# EAGLE design boosterpack (EAGLE 6.5.0)
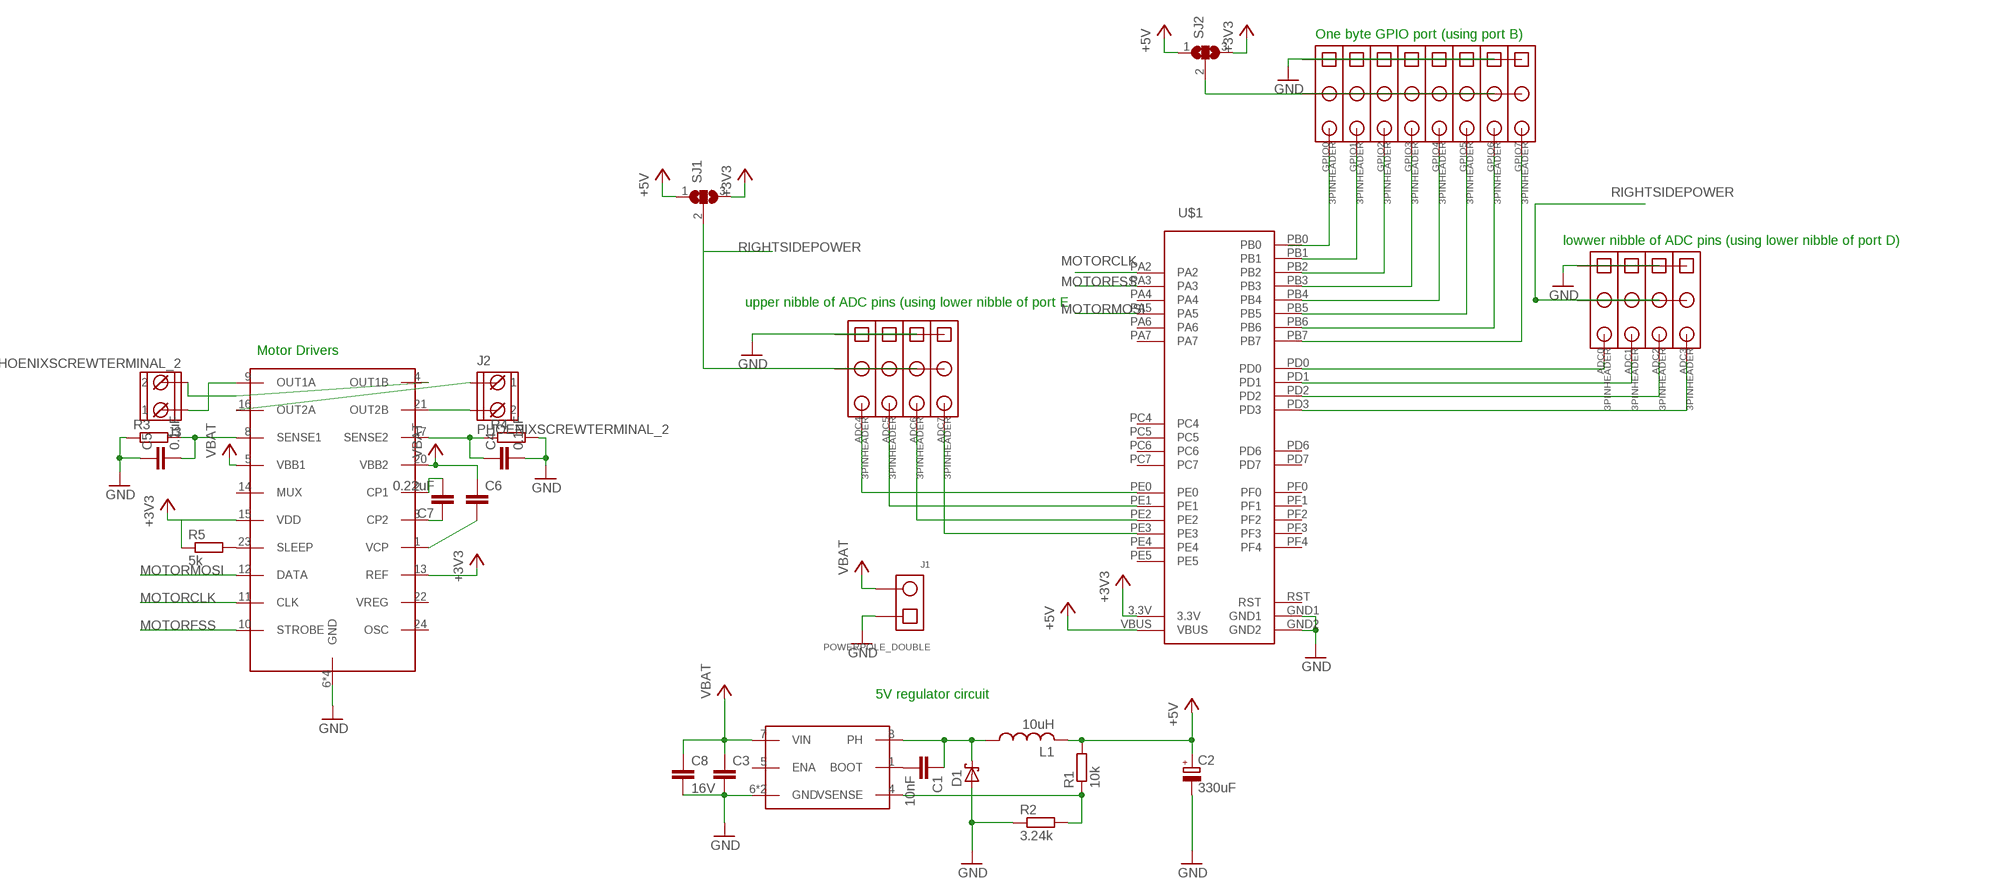
[diagram p0: schematic, sheet 1]

## Parts
ADC0  3PINHEADER  [3PINHEADER]
ADC1  3PINHEADER  [3PINHEADER]
ADC2  3PINHEADER  [3PINHEADER]
ADC3  3PINHEADER  [3PINHEADER]
ADC4  3PINHEADER  [3PINHEADER]
ADC5  3PINHEADER  [3PINHEADER]
ADC6  3PINHEADER  [3PINHEADER]
ADC7  3PINHEADER  [3PINHEADER]
C1  10nF  C-EU025-024X044  [C025-024X044]
C2  330uF  CPOL-EUB45181B  [B45181B]
C3  C-EU025-024X044  [C025-024X044]
C4  0.1uF  C-EU025-025X050  [C025-025X050]
C5  0.1uF  C-EU025-025X050  [C025-025X050]
C6  C-EU025-025X050  [C025-025X050]
C7  0.22uF  C-EU025-024X044  [C025-024X044]
C8  16V  C-EU050-075X075  [C050-075X075]
D1  SCHOTTKY-DIODEDO201T15  [DO201T15]
GPIO0  3PINHEADER  [3PINHEADER]
GPIO1  3PINHEADER  [3PINHEADER]
GPIO2  3PINHEADER  [3PINHEADER]
GPIO3  3PINHEADER  [3PINHEADER]
GPIO4  3PINHEADER  [3PINHEADER]
GPIO5  3PINHEADER  [3PINHEADER]
GPIO6  3PINHEADER  [3PINHEADER]
GPIO7  3PINHEADER  [3PINHEADER]
J1  POWERPOLE_DOUBLE  [POWERPOLE_DOUBLE]
J2  PHOENIXSCREWTERMINAL_2  [PHOENIXSCREWTERMINAL_2]
J3  PHOENIXSCREWTERMINAL_2  [PHOENIXSCREWTERMINAL_2]
L1  10uH  SDR1006  [SDR1006]
R1  10k  R-EU_0204/7  [0204/7]
R2  3.24k  R-EU_0204/7  [0204/7]
R3  R-EU_0204/7  [0204/7]
R4  R-EU_0204/7  [0204/7]
R5  5k  R-EU_0204/7  [0204/7]
SJ1  SJ2W  [SJ_2]
SJ2  SJ2W  [SJ_2]
U$1  STELLARIS-LAUNCHPADSTELLARIS-LAUNCHPAD-XL  [LAUNCHPAD-XL]
U$2  TPS5450  [DDS]
U$3  A3992A  [DIP24]

## Nets
+3V3: R5.1 SJ1.3 SJ2.3 U$1.3.3V U$3.13(REF) U$3.15(VDD)
+5V: C2.+ L1.P$2 R1.2 SJ1.1 SJ2.1 U$1.VBUS
ADC1: ADC1.3 U$1.PD1
ADC2: ADC2.3 U$1.PD2
ADC3: ADC3.3 U$1.PD3
ADC5: ADC5.3 U$1.PE1
GND: ADC0.1 ADC1.1 ADC2.1 ADC3.1 ADC4.1 ADC5.1 ADC6.1 ADC7.1 C2.- C3.2 C4.2 C5.1 C8.2 D1.A GPIO0.1 GPIO1.1 GPIO2.1 GPIO3.1 GPIO4.1 GPIO5.1 GPIO6.1 GPIO7.1 J1.1 R2.1 R3.1 R4.2 U$1.GND1 U$1.GND2 U$2.6(GND) U$2.GROUNDPAD(GND) U$3.6(GND) U$3.7(GND) U$3.18(GND) U$3.19(GND)
GPIO0: GPIO0.3 U$1.PB0
GPIO1: GPIO1.3 U$1.PB1
GPIO2: GPIO2.3 U$1.PB2
GPIO3: GPIO3.3 U$1.PB3
MOTORCLK: U$1.PA2 U$3.11(CLK)
MOTORFSS: U$1.PA3 U$3.10(STROBE)
MOTORMOSI: U$1.PA5 U$3.12(DATA)
N$1: ADC0.3 U$1.PD0
N$2: GPIO4.3 U$1.PB4
N$3: GPIO5.3 U$1.PB5
N$4: ADC6.3 U$1.PE2
N$5: ADC7.3 U$1.PE3
N$6: GPIO6.3 U$1.PB6
N$7: GPIO0.2 GPIO1.2 GPIO2.2 GPIO3.2 GPIO4.2 GPIO5.2 GPIO6.2 GPIO7.2 SJ2.2
N$8: GPIO7.3 U$1.PB7
N$9: C1.2 U$2.1(BOOT)
N$10: R1.1 R2.2 U$2.4(VSENSE)
N$11: C1.1 D1.C L1.P$1 U$2.8(PH)
N$13: ADC4.3 U$1.PE0
N$14: J3.2 U$3.4(OUT1B)
N$15: J3.1 U$3.9(OUT1A)
N$17: J2.1 U$3.16(OUT2A)
N$18: J2.2 U$3.21(OUT2B)
N$19: C5.2 R3.2 U$3.8(SENSE1)
N$20: C4.1 R4.1 U$3.17(SENSE2)
N$21: C6.2 U$3.1(VCP)
N$22: R5.2 U$3.23(SLEEP)
N$23: C7.1 U$3.3(CP2)
N$28: C7.2 U$3.2(CP1)
RIGHTSIDEPOWER: ADC0.2 ADC1.2 ADC2.2 ADC3.2 ADC4.2 ADC5.2 ADC6.2 ADC7.2 SJ1.2
VCC: C3.1 C6.1 C8.1 J1.2 U$2.7(VIN) U$3.5(VBB1) U$3.20(VBB2) ; supply symbol labelled VBAT
Unconnected: U$1.PA4 U$1.PA6 U$1.PA7 U$1.PC4 U$1.PC5 U$1.PC6 U$1.PC7 U$1.PD6 U$1.PD7 U$1.PE4 U$1.PE5 U$1.PF0 U$1.PF1 U$1.PF2 U$1.PF3 U$1.PF4 U$2.5(ENA) U$3.14(MUX) U$3.22(VREG) U$3.24(OSC)

## Notes on the sheet
- One byte GPIO port (using port B)
- lowwer nibble of ADC pins (using lower nibble of port D)
- upper nibble of ADC pins (using lower nibble of port E
- Motor Drivers
- 5V regulator circuit

## Power pins joined to a net without a drawn wire
RST: U$1.RST

## Library data of the parts
ADC0 ADC1-ADC7 GPIO0 GPIO1-GPIO7 = RASEagleLib:3PINHEADER: 3 Pin Header 0.1" Headers
C1 C3-C8 = resistor:C-EU: CAPACITOR, European symbol
C2 = rcl:CPOL-EU: POLARIZED CAPACITOR, European symbol
D1 = diode:SCHOTTKY-DIODE: Schottky Diode
J1 = RASEagleLib:POWERPOLE_DOUBLE: Double PowerPole Connector Good for battery connections.
J2 J3 = RASEagleLib:PHOENIXSCREWTERMINAL_2: Phoenix Screw Terminal 2 contacts, 5 mm pitch Terminal: 1934861 Pins: 1933189
L1 = RASEagleLib:SDR1006
R1-R5 = rcl:R-EU_: RESISTOR, European symbol
SJ1 SJ2 = jumper:SJ2W: SMD solder JUMPER
U$1 = StellarisLaunchPad_Fred:STELLARIS-LAUNCHPAD
U$2 = packages(ti):TPS5450
U$3 = RASEagleLib:A3992

## Board
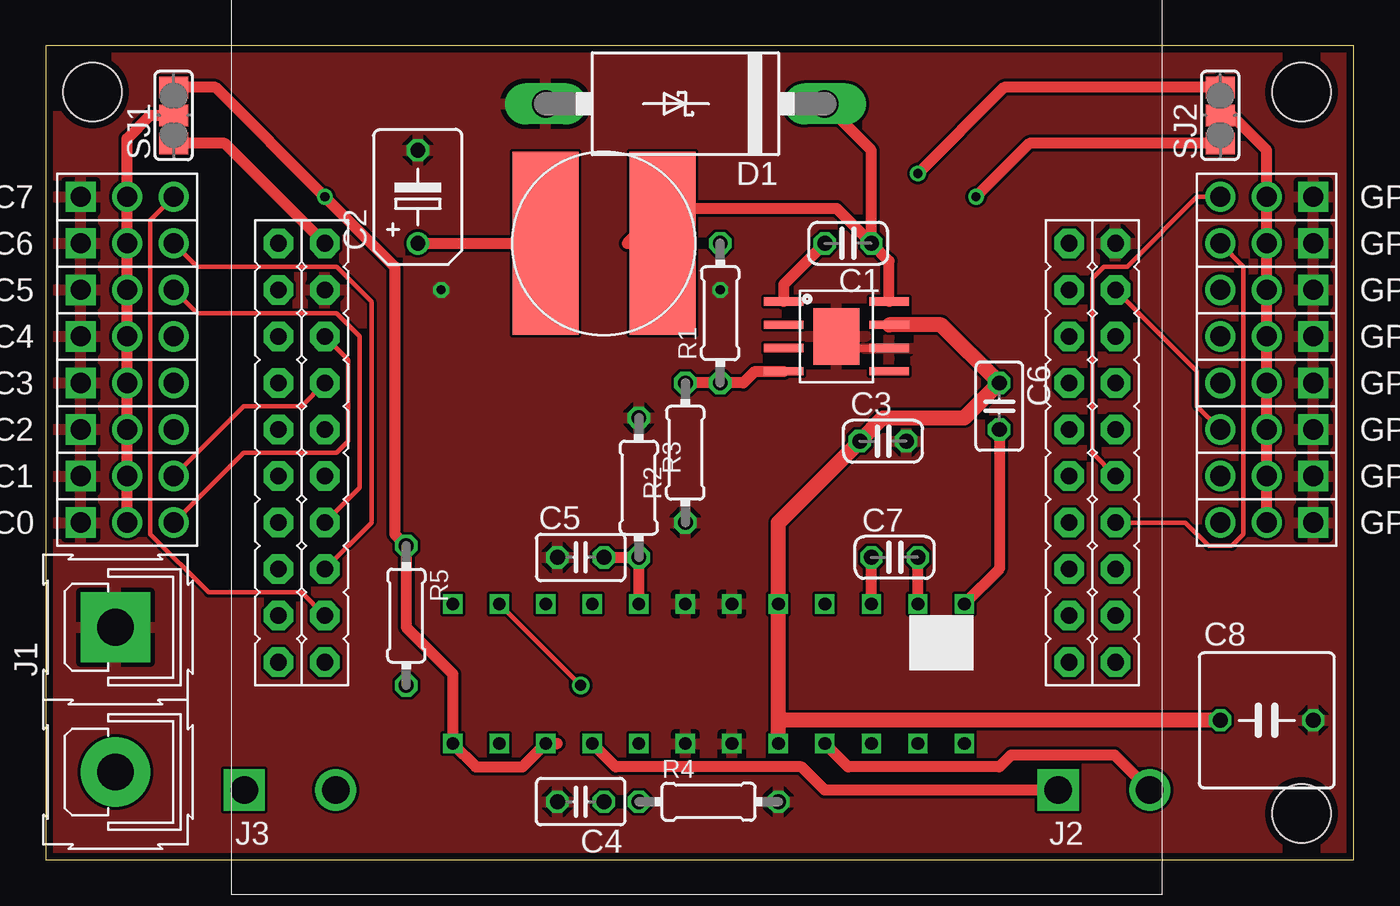
[diagram p1: board, top side]
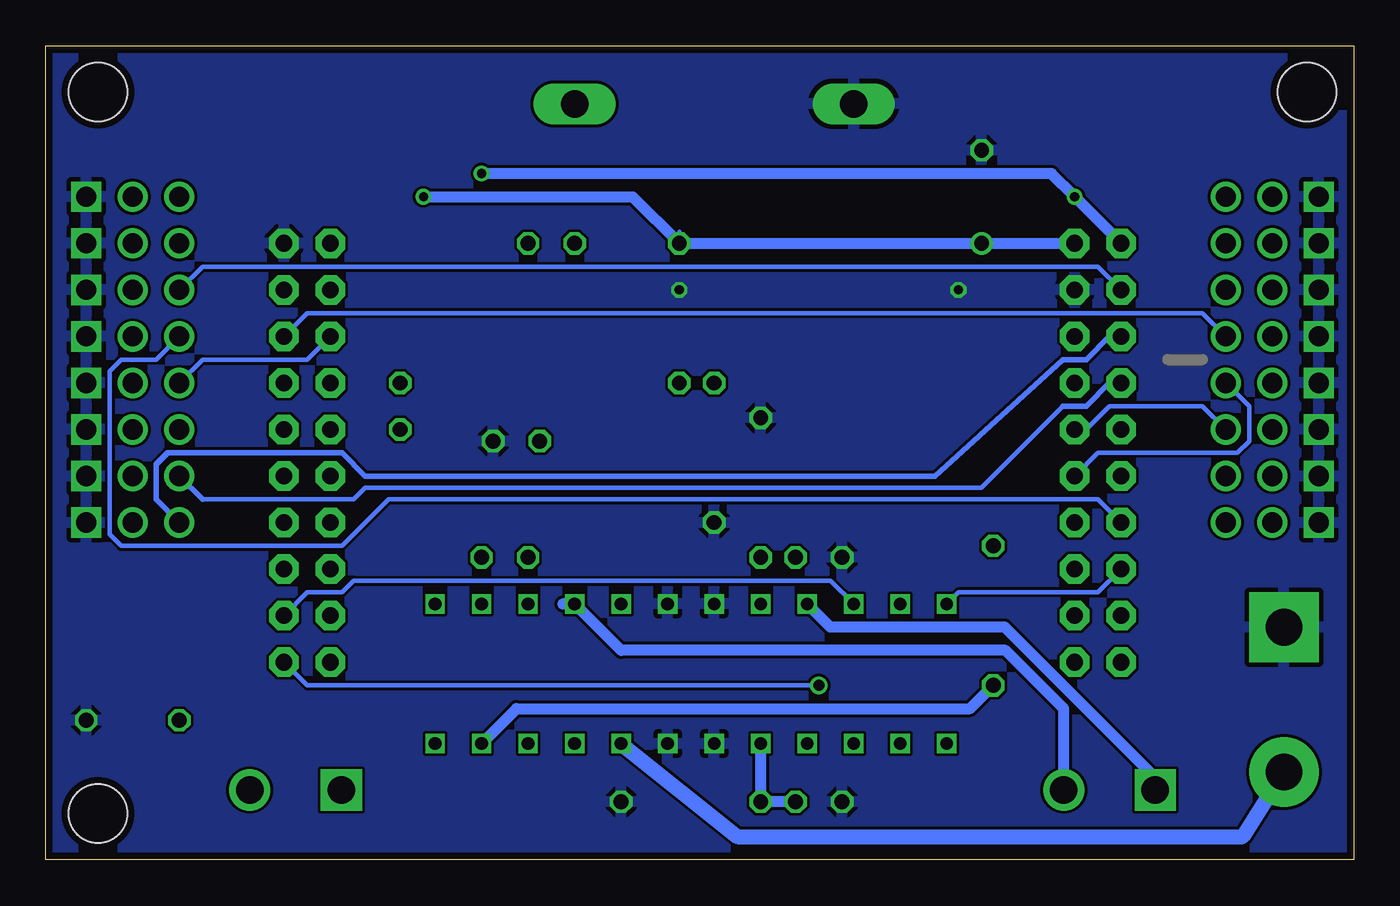
[diagram p2: board, bottom side, seen from below]

Size 71.42 x 44.44 mm. Coordinates in mm from the lower left corner, seen from the top.
Outline: 0,0 71.42,0 71.42,44.44 0,44.44 0,0
Copper layers (1*16): Top 0.0356mm / dielectric 1.5011mm / Bottom 0.0356mm
Design rules "LaenPCBOrder": minimum track width 6mil, minimum drill 13mil, track to track 6mil, track to pad 6mil, pad to pad 6mil, via to via 6mil, smd to smd 6mil, copper to edge 15mil, drill to drill 6mil, minimum pad ring 7mil, minimum via ring 7mil, stop-mask expansion 3mil, vias tented up to drill 0mil, thermal gap 10mil
Holes 3.2 mm at 2.54,41.91 68.58,41.91 68.58,2.54

### Footprints (pad centres in the part's own frame; a part is rotated, then mirrored left to right if it is on the bottom)
3PINHEADER = drill 1.1 square: 1 0,0 | drill 1.1: 2 2.54,0; 3 5.08,0
C025-024X044 = drill 0.813 octagon: 1 -1.27,0; 2 1.27,0
B45181B = drill 0.813: + -2.54,0 | drill 0.813 octagon: - 2.54,0
C025-025X050 = drill 0.813 octagon: 1 -1.27,0; 2 1.27,0
C050-075X075 = drill 0.813 octagon: 1 -2.54,0; 2 2.54,0
DO201T15 = drill 1.499 long: A 7.62,0; C -7.62,0
POWERPOLE_DOUBLE = drill 2 pad 3.81 square: 1 0,0 | drill 2 pad 3.81: 2 7.9,0
PHOENIXSCREWTERMINAL_2 = drill 1.5 square: 1 -2.5,0 | drill 1.5: 2 2.5,0
SDR1006 = smd 10 x 3.6: P$1 0,3.2; P$2 0,-3.2
0204/7 = drill 0.813 octagon: 1 -3.81,0; 2 3.81,0
SJ_2 = smd 1.168 x 1.6: 1 -1.524,0; 2 0,0; 3 1.524,0
LAUNCHPAD-XL = drill 0.914 pad 1.6 octagon: 3.3V 30.48,2.54; GND1 33.02,5.08; GND2 30.48,48.26; PA2 53.34,48.26; PA3 50.8,48.26; PA4 48.26,48.26; PA5 48.26,2.54; PA6 50.8,2.54; PA7 53.34,2.54; PB0 35.56,2.54; PB1 38.1,2.54; PB2 33.02,48.26; PB3 35.56,45.72; PB4 45.72,2.54; PB5 33.02,2.54; PB6 45.72,48.26; PB7 43.18,48.26; PC4 38.1,45.72; PC5 40.64,45.72; PC6 43.18,45.72; PC7 45.72,45.72; PD0 35.56,5.08; PD1 38.1,5.08; PD2 40.64,5.08; PD3 43.18,5.08; PD6 48.26,45.72; PD7 50.8,45.72; PE0 35.56,48.26; PE1 45.72,5.08; PE2 48.26,5.08; PE3 50.8,5.08; PE4 40.64,2.54; PE5 43.18,2.54; PF0 38.1,48.26; PF1 53.34,5.08; PF2 30.48,45.72; PF3 33.02,45.72; PF4 53.34,45.72; RST 40.64,48.26; VBUS 30.48,5.08
DDS = smd 2.15 x 0.45: 1 -2.875,1.905; 2 -2.875,0.635; 3 -2.875,-0.635; 4 -2.875,-1.905; 5 2.875,-1.905; 6 2.875,-0.635; 7 2.875,0.635; 8 2.875,1.905 | smd 2.49 x 3.1: GROUNDPAD 0,0
DIP24 = drill 0.7 square: 1 7.62,0; 2 7.62,2.54; 3 7.62,5.08; 4 7.62,7.62; 5 7.62,10.16; 6 7.62,12.7; 7 7.62,15.24; 8 7.62,17.78; 9 7.62,20.32; 10 7.62,22.86; 11 7.62,25.4; 12 7.62,27.94; 13 0,27.94; 14 0,25.4; 15 0,22.86; 16 0,20.32; 17 0,17.78; 18 0,15.24; 19 0,12.7; 20 0,10.16; 21 0,7.62; 22 0,5.08; 23 0,2.54; 24 0,0

### Placement (x,y rotation side)
ADC0  1.91,18.41 0 top
ADC1  1.91,20.95 0 top
ADC2  1.91,23.49 0 top
ADC3  1.91,26.04 0 top
ADC4  1.91,28.58 0 top
ADC5  1.91,31.12 0 top
ADC6  1.91,33.66 0 top
ADC7  1.91,36.2 0 top
C1  43.81,33.66 180 top
C2  20.32,36.2 90 top
C3  45.72,22.86 0 top
C4  29.21,3.18 180 top
C5  29.21,16.51 0 top
C6  52.07,24.77 270 top
C7  46.36,16.51 0 top
C8  66.67,7.62 0 top
D1  34.92,41.27 180 top
GPIO0  69.22,18.41 180 top
GPIO1  69.22,20.95 180 top
GPIO2  69.22,23.49 180 top
GPIO3  69.22,26.04 180 top
GPIO4  69.22,28.58 180 top
GPIO5  69.22,31.12 180 top
GPIO6  69.22,33.66 180 top
GPIO7  69.22,36.2 180 top
J1  3.81,12.7 270 top
J2  57.78,3.81 0 top
J3  13.34,3.81 0 top
L1  30.48,33.66 270 top
R1  36.83,29.84 90 top
R2  34.92,22.23 90 top
R3  32.39,20.32 270 top
R4  36.2,3.18 0 top
R5  19.68,13.34 270 top
SJ1  6.98,40.64 90 top
SJ2  64.13,40.64 90 top
U$1  10.16,64.13 270 top
U$2  43.18,28.58 0 top
U$3  50.17,6.35 90 top

### Tracks (layer width: path | path; a pad name or v marks a point on that pad's centre or on a via)
+3V3  (via drill 0.5)
  Top 0.61: 7.24,41.91 SJ1.3 9.27,42.16 v15.24,36.2 19.05,32.38 19.05,17.78 R5.1 19.68,12.7 22.22,10.16 U$3.13 23.5,5.08 26.04,5.08 U$3.15 27.94,6.35 | 64.13,42.54 SJ2.3 52.32,42.16 v47.62,37.46
  Bottom 0.61: U$1.3.3V v15.24,36.2 16.51,37.46 v47.62,37.46
+5V  (via drill 0.5)
  Top 0.61: SJ2.1 53.72,39.12 v50.8,36.2 | U$1.VBUS 9.78,39.12 SJ1.1 | C2.+ L1.P$2
  Bottom 0.254: R1.2 36.83,34.29
  Bottom 0.61: v50.8,36.2 39.37,36.2 R1.2 C2.+ U$1.VBUS
ADC1
  Top 0.254: U$1.PD1 13.97,24.77 10.8,24.77 ADC1.3
ADC2
  Bottom 0.254: U$1.PD2 14.61,23.49 13.34,24.77 8.25,24.77 ADC2.3
ADC3
  Bottom 0.254: U$1.PD3 13.97,22.23 6.35,22.23 5.71,22.86 5.71,24.77 ADC3.3
ADC5
  Top 0.254: U$1.PE1 17.14,20.32 17.14,28.58 15.88,29.84 8.25,29.84 ADC5.3
GND  (via drill 0.5)
  Top 0.406: U$2.6 43.18,27.94 U$2.GROUNDPAD
  other vias: 21.59,31.12 36.83,31.12
  pour Top: 0,44.45 71.75,44.45 71.75,0 0,0
  pour Bottom: 0,44.45 71.75,44.45 71.75,0 0,0
GPIO0
  Bottom 0.305: U$1.PB0 13.34,28.58 14.61,27.3 15.88,27.3 22.86,20.95 53.97,20.95 55.24,22.23 64.77,22.23 65.41,21.59 65.41,19.69 GPIO0.3
GPIO1
  Bottom 0.254: 62.86,19.69 54.61,19.69 53.97,20.32 20.32,20.32 15.88,24.77
  Bottom 0.305: U$1.PB1 13.34,26.04 14.61,24.77 15.88,24.77 | 62.86,19.69 GPIO1.3
GPIO2
  Top 0.254: U$1.PB2 62.86,26.67 62.86,24.77 GPIO2.3
GPIO3
  Bottom 0.254: U$1.PB3 57.15,27.3 62.86,27.3 GPIO3.3
MOTORCLK  (via drill 0.61)
  Top 0.254: v29.21,9.52 U$3.11
  Bottom 0.254: v29.21,9.52 57.15,9.52 U$1.PA2
MOTORFSS
  Bottom 0.254: U$3.10 28.57,15.24 54.61,15.24 55.24,14.6 57.15,14.6 U$1.PA3
MOTORMOSI
  Bottom 0.254: U$3.12 21.59,14.6 13.97,14.6 U$1.PA5
N$1
  Top 0.254: U$1.PD0 16.51,27.3 16.51,22.86 15.88,22.23 10.8,22.23 ADC0.3
N$2
  Bottom 0.254: U$1.PB4 13.97,19.69 52.7,19.69 55.24,17.15 67.31,17.15 67.94,17.78 67.94,26.67 67.31,27.3 65.41,27.3 GPIO4.3
N$3
  Bottom 0.254: U$1.PB5 13.97,32.38 62.86,32.38 GPIO5.3
N$4
  Top 0.254: U$1.PE2 17.78,18.41 17.78,30.48 15.88,32.38 8.25,32.38 ADC6.3
N$5
  Top 0.254: U$1.PE3 13.97,14.6 8.89,14.6 5.71,17.78 5.71,34.92 ADC7.3
N$6
  Top 0.254: U$1.PB6 62.23,18.41 63.5,17.15 64.77,17.15 65.41,17.78 65.41,32.38 GPIO6.3
N$7
  Top 0.61: GPIO0.2 GPIO1.2 GPIO2.2 GPIO3.2 GPIO4.2 GPIO5.2 GPIO6.2 GPIO7.2 66.67,38.74 64.77,40.64 SJ2.2
N$8
  Top 0.254: U$1.PB7 57.15,22.23 57.15,31.75 57.78,32.38 59.05,32.38 62.86,36.2 GPIO7.3
N$9
  Top 0.61: U$2.1 40.31,31.41 C1.2
N$10
  Top 0.61: U$2.4 38.73,26.67 38.1,26.04 R1.1 R2.2
N$11
  Top 0.61: U$2.8 46.06,32.69 C1.1 | C1.1 45.08,38.74 D1.C | L1.P$1 31.75,33.66 33.66,35.56 43.18,35.56 C1.1
N$13
  Bottom 0.254: U$1.PE0 57.15,29.84 8.25,29.84 ADC4.3
N$14
  Bottom 0.61: 43.18,13.97 U$3.4 40,11.43 19.01,11.43 15.84,8.26 J3.2
N$15
  Bottom 0.61: U$3.9 28.57,12.7 19.05,12.7 12.38,6.03 12.07,5.72 10.84,4.48 J3.1
N$17
  Top 0.61: J2.1 42.55,3.81 41.28,5.08 31.11,5.08 U$3.16
N$18
  Top 0.61: U$3.21 43.81,5.08 52.07,5.08 52.7,5.72 58.38,5.72 J2.2
N$19
  Top 0.61: U$3.8 R3.2 C5.2
N$20
  Bottom 0.61: C4.1 R4.1 U$3.17
N$21
  Top 0.61: C6.2 52.07,15.88 U$3.1
N$22
  Bottom 0.61: U$3.23 45.72,8.26 20.96,8.26 R5.2
N$23
  Top 0.61: U$3.3 C7.1
N$28
  Top 0.61: U$3.2 C7.2
RIGHTSIDEPOWER
  Top 0.61: ADC0.2 ADC1.2 ADC2.2 ADC3.2 ADC4.2 ADC5.2 ADC6.2 ADC7.2 4.45,39.37 5.71,40.64 SJ1.2
VCC
  Top 0.813: U$3.20 40,7.62 | 40,7.62 U$3.5 40,18.41 C3.1 45.72,24.13 50.17,24.13 C6.1 48.89,29.21 U$2.7 | C8.1 40,7.62
  Bottom 0.813: J1.2 6.07,1.27 33.66,1.27 U$3.20

### Text on the board
tDocu: 5v | 5v | 3v3 | 3v3
bDocu: Port E | 3 | 7 | 2 | 6 | 1 | 5 | 0 | 4 | 3 | 3 | 2 | 2 | 1 | 1 | 0 | 0 | Ground | + | Signal | Port D | Port B | Signal | Power | Ground